# Altium project SensorControl_Board_v3.0.PrjPcb
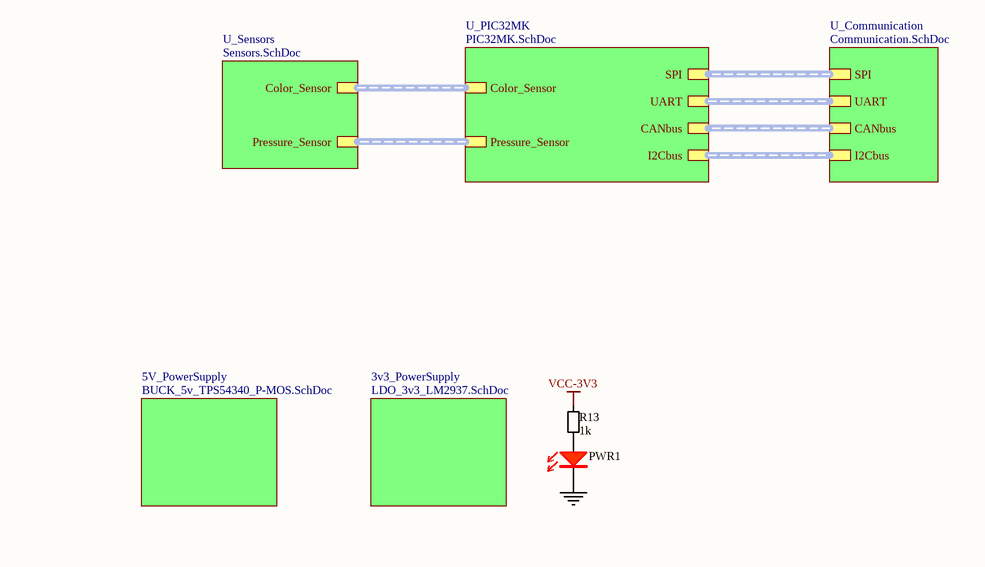
[diagram p0: SensorControl_Board_v3.0.SchDoc]
5 sheets, 84 parts. Net scope: hierarchical (ports join the sheet entries above them; power ports are global).
Board file: SensorControl_Board_v3.0.PcbDoc
Sheets:
  SensorControl_Board_v3.0.SchDoc
    5V_PowerSupply = BUCK_5v_TPS54340_P-MOS.SchDoc
    U_Sensors = Sensors.SchDoc
      Pressure_Sensor1 = Pressure_Sensor.SchDoc
      Pressure_Sensor2 = Pressure_Sensor.SchDoc
      Pressure_Sensor3 = Pressure_Sensor.SchDoc
      Pressure_Sensor4 = Pressure_Sensor.SchDoc
      Pressure_Sensor5 = Pressure_Sensor.SchDoc
      Pressure_Sensor6 = Pressure_Sensor.SchDoc
      Pressure_Sensor7 = Pressure_Sensor.SchDoc
      Pressure_Sensor8 = Pressure_Sensor.SchDoc
      Pressure_Sensor9 = Pressure_Sensor.SchDoc
      Pressure_Sensor10 = Pressure_Sensor.SchDoc
    U_PIC32MK = PIC32MK.SchDoc

## Sheet SensorControl_Board_v3.0.SchDoc
size A

### Parts
PWR1  LED RED  [LED_RED_0805]  (value not drawn)
R13  1k  [RESC2013X38N-0805-NOOVERLAY]

### Sub-sheets
3v3_PowerSupply = LDO_3v3_LM2937.SchDoc (file not in this document): no entries
5V_PowerSupply = BUCK_5v_TPS54340_P-MOS.SchDoc: no entries
U_Communication = Communication.SchDoc (file not in this document): SPI (harness SPI), UART (harness UART), CANbus (harness CANbus), I2Cbus (harness I2Cbus)
U_PIC32MK = PIC32MK.SchDoc: Color_Sensor (harness Color_Sensor), Pressure_Sensor (harness Pressure_Sensor), SPI (harness SPI), UART (harness UART), CANbus (harness CANbus), I2Cbus (harness I2Cbus)
U_Sensors = Sensors.SchDoc: Color_Sensor (harness Color_Sensor), Pressure_Sensor (harness Pressure_Sensor)

### Nets
GND: PWR1.1(C)
VCC-3V3: R13.2
NetPWR1_2: PWR1.2(A) R13.1

### Buses and harness runs
harness sheet U_Communication/CANbus = sheet U_PIC32MK/CANbus
harness sheet U_Communication/I2Cbus = sheet U_PIC32MK/I2Cbus
harness sheet U_Communication/SPI = sheet U_PIC32MK/SPI
harness sheet U_Communication/UART = sheet U_PIC32MK/UART
harness sheet U_PIC32MK/Color_Sensor = sheet U_Sensors/Color_Sensor
harness sheet U_PIC32MK/Pressure_Sensor = sheet U_Sensors/Pressure_Sensor

### Library data of the parts
PWR1 = LED_RED_0805: LED RED 0805; Manufacturer: BRIGHT LED ELECTRONICS; Manufacturer Part Number: BL-HUB35A-AV-TRB; Barcode: 2911010024321; id: 35; Assembly: SMD; Voltage Forward: 2.0 V; item_id: 3341; Recommended Rating: Platinum; Package Case: 0805 (2012 Metric); Color: Red; Family: LED; Part Type: Optoelectronics
R13 = 00001001: RES SMD 1 kOhm 1/8W 0805; Power: 0.125W, 1/8W; Barcode: 00009101; Resistance: 1k; Assembly: SMD

## Sheet BUCK_5v_TPS54340_P-MOS.SchDoc: Memristor Power 5.0
size A4; Author: Nikola Rašević; Organization: Memristor-Robotics; Address1: Vladimira Perića Valtera 2; Address2: 21000 Novi Sad; Address3: Serbia; Revision: v1
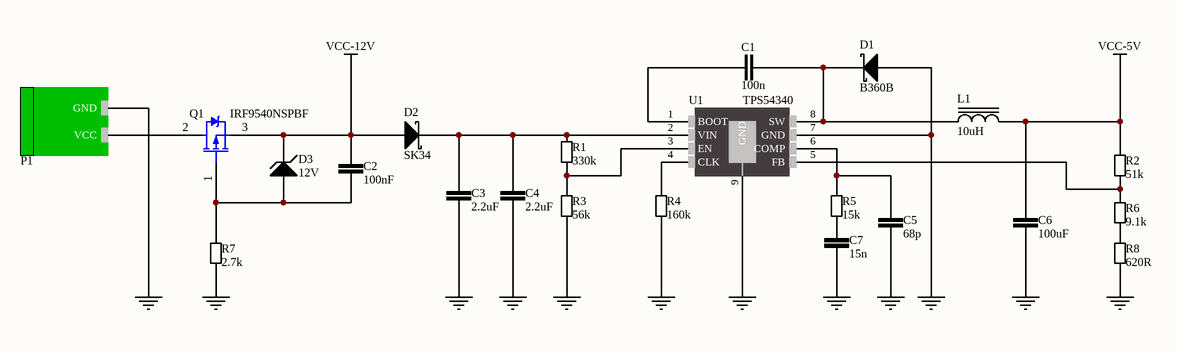
[diagram p1: BUCK_5v_TPS54340_P-MOS.SchDoc]

### Parts
C1  100n  [CER_0603]
C2  100nF  [CER_0805]
C3  2.2uF  [CER_1210]
C4  2.2uF  [CER_1210]
C5  68p  [CER_0603]
C6  100uF  [CER_1210]
C7  15n  [CER_0603]
D1  B360B  [DO214AC]
D2  SK34  [DO214AC]
D3  12V  [DO214AC]
L1  10uH  [INDUCTOR_SS1260-103MLD]
P1  2EDGRC-5.08-02P-14-00A(H)  [PWR_Con]  (value not drawn)
Q1  IRF9540NSPBF  [D2PAK-2]
R1  330k  [RESC2013X38N-0805-NOOVERLAY]
R2  51k  [RESC2013X38N-0805-NOOVERLAY]
R3  56k  [RESC2013X38N-0805-NOOVERLAY]
R4  160k  [RESC2013X38N-0805-NOOVERLAY]
R5  15k  [RESC2013X38N-0805-NOOVERLAY]
R6  9.1k  [RESC2013X38N-0805-NOOVERLAY]
R7  2.7k  [RESC2013X38N-0805-NOOVERLAY]
R8  620R  [RESC2013X38N-0805-NOOVERLAY]
U1  TPS54340  [HSOP-8]

### Nets
GND: C3.1 C4.1 C5.1 C6.1 C7.1 D1.2(Anode) P1.1(GND) R3.1 R4.1 R7.1 R8.1 U1.7(GND) U1.9(GND)
VCC-5V: C6.2 L1.2 R2.2
VCC-12V: C2.2 D2.2(Anode) D3.1(Cathode) Q1.3(S)
NetC1_1: C1.1 U1.1(BOOT)
NetC1_2: C1.2 D1.1(Cathode) L1.1 U1.8(SW)
NetC2_1: C2.1 D3.2(Anode) Q1.1(G) R7.2
NetC3_2: C3.2 C4.2 D2.1(Cathode) R1.2 U1.2(VIN)
NetC5_2: C5.2 R5.2 U1.6(COMP)
NetC7_2: C7.2 R5.1
NetP1_2: P1.2(VCC) Q1.2(D)
NetR1_1: R1.1 R3.2 U1.3(EN)
NetR2_1: R2.1 R6.2 U1.5(FB)
NetR4_2: R4.2 U1.4(CLK)
NetR6_1: R6.1 R8.2

### Notes on the sheet
- Title
- Date:
- Design Engineer:
- Time:
- Revision:
- Sheet
- of
- Size:
- A4
- www.memristor-robotics.io
- File:

### Library data of the parts
C1 = 06032105: CAP CER 100n 10V X5R 10% 0603; Capacitance: 100n
C2 = 00002105: CAP CER 100n 50V X7R 10% 0805; Capacitance: 100nF
C3 C4 = 00001225: CAP CER 2.2u; Value: 2.2uF
C5 = 06032680: CAP CER 68p 0603; Capacitance: 68p
C6 = 00002108: CAP CER 100u X5R 6.3V 10% 1210; Capacitance: 100uF
C7 = 06032153: CAP CER 15n 0603; Capacitance: 15n
D1 = B360B: DIODE SCHOTTKY 60V 3A DO214AC; Manufacturer: Vishay Semiconductor Diodes Division; Barcode: 0100000007488; id: 62; Assembly: SMD; Speed: Fast Recovery =< 500ns, > 200mA (Io); Voltage  Forward: 550mV @ 3A; item_id: 1025; Recommended Rating: Silver; Manufacturer Part Number: B360B; Category: Discrete Semiconductor Products; Datasheet URL: http://www.vishay.com/docs/88896/b330la.pdf; Package Case: DO-214AC, SMA; Family: DIODE; Voltage  DC Reverse: 60V; Current  Average Rectified: 3A; Diode Type: Schottky; Part Type: Discrete Semiconductors
D2 = SK34: DIODE SCHOTTKY 40V 3A DO214AC; Manufacturer: Vishay Semiconductor Diodes Division; Barcode: 0100000007488; id: 62; Assembly: SMD; Speed: Fast Recovery =< 500ns, > 200mA (Io); Voltage  Forward: 550mV @ 3A; item_id: 1025; Recommended Rating: Silver; Manufacturer Part Number: SK34; Category: Discrete Semiconductor Products; Datasheet URL: http://www.vishay.com/docs/88896/b330la.pdf; Package Case: DO-214AC, SMA; Family: DIODE; Voltage  DC Reverse: 40V; Current  Average Rectified: 3A; Diode Type: Schottky; Part Type: Discrete Semiconductors
D3 = ZENER: DIODE ZENER; Manufacturer: Vishay Semiconductor Diodes Division; Manufacturer Part Number: B360B; Barcode: 0100000007488; id: 62; Assembly: SMD; Speed: Fast Recovery =< 500ns, > 200mA (Io); Voltage  DC Reverse: 60V; Current  Average Rectified: 3A; Voltage  Forward: 550mV @ 3A; Diode Type: Schottky; item_id: 1025; Recommended Rating: Silver; Category: Discrete Semiconductor Products; Datasheet URL: http://www.vishay.com/docs/88896/b330la.pdf; Package Case: DO-214AC, SMA; Family: DIODE; Part Type: Discrete Semiconductors; Refferent Voltage: 12V
L1 = Inductor_10uH: FIXED IND 10uH 5.3A; Manufacturer: Coilcraft; Manufacturer Part Number: XAL7030-103MEB; Barcode: 2911010049126; id: 7; Assembly: SMD; Tolerance: 20%; Value: 10u; DC Resistance: 62.7mOhm; item_id: 5593; Category: Inductors, Coils, Chokes; Datasheet URL: http://www.mouser.com/ds/2/597/xal7030-270749.pdf; Package Case: 8x8mm; Inductance: 10uH; Current Rating: 5.3A; Family: INDUCTOR; Part Type: Inductor, Transf, Filter, Ferrite
P1 = 00000002: TERM BLOCK HDR 2POS 90DEG 5.08MM; Suplier: TME; Manufacturer Part Number: 2EDGRC-5.08-02P-14-00A(H); Suplier Product Link: https://www.tme.eu/en/details/2edgrc5.08-2p14/pluggable-terminal-blocks/degson-electronics/2edgrc-508-02p-14-00ah/; Price: 0.1304
Q1 = IRF9540N: P-MOS; Manufacturer: INTERNATIONAL RECTIFIER; Manufacturer Part Number: IRF9540NSPBF; Order Code: IRF9540NS; Package: TO-263 SMD; Price: DIN 62.54; Supplier: Comet.rs
R1 = 00003303: RES SMD 330 kOhm 1/8W 0805; Power: 0.125W, 1/8W; Resistance: 330k; Assembly: SMD; Barcode: 00003303
R2 = 00005102: RES SMD 51 kOhm 1/8W 0805; Power: 0.125W, 1/8W; Resistance: 51k; Assembly: SMD; Barcode: 00005102
R3 = 00005602: RES SMD 56 kOhm 1/8W 0805; Power: 0.125W, 1/8W; Barcode: 00004701; Resistance: 56k; Assembly: SMD
R4 = 00001603: RES SMD 160 kOhm 1/8W 0805; Power: 0.125W, 1/8W; Resistance: 160k; Assembly: SMD; Barcode: 00001603
R5 = 00001502: RES SMD 15 kOhm 1/8W 0805; Power: 0.125W, 1/8W; Resistance: 15k; Assembly: SMD; Barcode: 00001502
R6 = 00009101: RES SMD 9.1 kOhm 1/8W 0805; Power: 0.125W, 1/8W; Resistance: 9.1k; Assembly: SMD; Barcode: 00009101
R7 = 00002701: RES SMD 2.7 kOhm 1/8W 0805; Power: 0.125W, 1/8W; Barcode: 00004701; Resistance: 2.7k; Assembly: SMD
R8 = 00006200: RES SMD 620 Ohm 1/8W 0805; Power: 0.125W, 1/8W; Resistance: 620R; Assembly: SMD; Barcode: 00006200
U1 = TPS54340: IC REG BUCK ADJ 3.5A 8SOPWRPAD; Assembly: SMD; Manufacturer Part Number: TPS54340

## Sheet Sensors.SchDoc
size A4
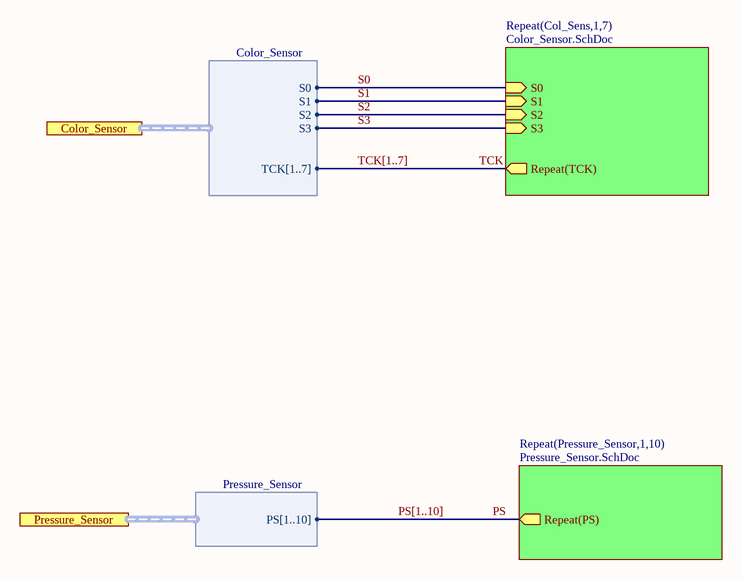
[diagram p2: Sensors.SchDoc]

### Sub-sheets
Repeat(Col_Sens,1,7) = Color_Sensor.SchDoc (file not in this document): S0 (in), S1 (in), S2 (in), S3 (in), Repeat(TCK) (out)
Repeat(Pressure_Sensor,1,10) = Pressure_Sensor.SchDoc: Repeat(PS) (out)

### Ports
Color_Sensor (harness Color_Sensor), Pressure_Sensor (harness Pressure_Sensor)

### Harnesses
Color_Sensor: TCK[1..7], S0, S1, S2, S3
Pressure_Sensor: PS[1..10]

### Nets
PS: sheet Repeat(Pressure_Sensor,1,10)/Repeat(PS)
S0: sheet Repeat(Col_Sens,1,7)/S0, port Color_Sensor.S0
S1: sheet Repeat(Col_Sens,1,7)/S1, port Color_Sensor.S1
S2: sheet Repeat(Col_Sens,1,7)/S2, port Color_Sensor.S2
S3: sheet Repeat(Col_Sens,1,7)/S3, port Color_Sensor.S3
TCK: sheet Repeat(Col_Sens,1,7)/Repeat(TCK)

### Buses and harness runs
bus PS[1..10]
bus TCK[1..7]

## Sheet Pressure_Sensor.SchDoc
size A4
Used 10 times, as channels U_Sensors/Pressure_Sensor1, U_Sensors/Pressure_Sensor2, U_Sensors/Pressure_Sensor3, U_Sensors/Pressure_Sensor4, U_Sensors/Pressure_Sensor5, U_Sensors/Pressure_Sensor6, U_Sensors/Pressure_Sensor7, U_Sensors/Pressure_Sensor8, U_Sensors/Pressure_Sensor9, U_Sensors/Pressure_Sensor10. Parts and nets are listed once, with the designators drawn on the sheet.
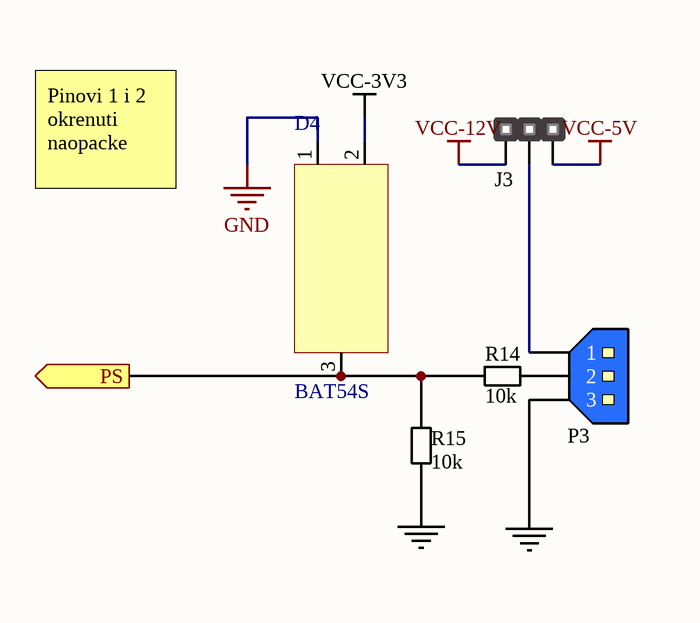
[diagram p3: Pressure_Sensor.SchDoc]

### Parts
D4  BAT54S  [BAT54S]
J3  *  [HM1X3]  (value not drawn)
P3  TE CONNECTIVITY_3PIN_MALE  [TE CONNECTIVITY_3PIN_MALE]  (value not drawn)
R14  10k  [RESC2013X38N-0805-NOOVERLAY]
R15  10k  [RESC2013X38N-0805-NOOVERLAY]

### Ports
PS (out)

### Nets
GND: P3.3 R15.1
VCC-5V: J3.3
VCC-12V: J3.1
PS: D4.3 R14.2 R15.2 ; port PS
NetJ3_2: J3.2 P3.1
NetP3_2: P3.2 R14.1

Not connected (* = marked no-connect by the designer): D4 1 2

### Channels
U_Sensors/Pressure_Sensor1: designators end in _Pressure_Sensor1; ports PS=PS1
U_Sensors/Pressure_Sensor2: designators end in _Pressure_Sensor2; ports PS=PS2
U_Sensors/Pressure_Sensor3: designators end in _Pressure_Sensor3; ports PS=PS3
U_Sensors/Pressure_Sensor4: designators end in _Pressure_Sensor4; ports PS=PS4
U_Sensors/Pressure_Sensor5: designators end in _Pressure_Sensor5; ports PS=PS5
U_Sensors/Pressure_Sensor6: designators end in _Pressure_Sensor6; ports PS=PS6
U_Sensors/Pressure_Sensor7: designators end in _Pressure_Sensor7; ports PS=PS7
U_Sensors/Pressure_Sensor8: designators end in _Pressure_Sensor8; ports PS=PS8
U_Sensors/Pressure_Sensor9: designators end in _Pressure_Sensor9; ports PS=PS9
U_Sensors/Pressure_Sensor10: designators end in _Pressure_Sensor10; ports PS=PS10

### Notes on the sheet
- Pinovi 1 i 2 okrenuti naopacke

### Library data of the parts
J3 = HEADER_1x3: Manufacturer Part Number: *
P3 = TE CONNECTIVITY_3PIN_MALE: BLUE_3PIN_CONECTOR; Manufacturer: TE CONNECTIVITY / AMP; Manufacturer Part Number 1: 281695-3; Order Code 1: 1205983; Price 1: £0.403; Supplier 1: uk.farnell.com
R14 R15 = 000001002: RES SMD 10 kOhm 1/8W 0805; Resistance: 10k

## Sheet PIC32MK.SchDoc
size A3
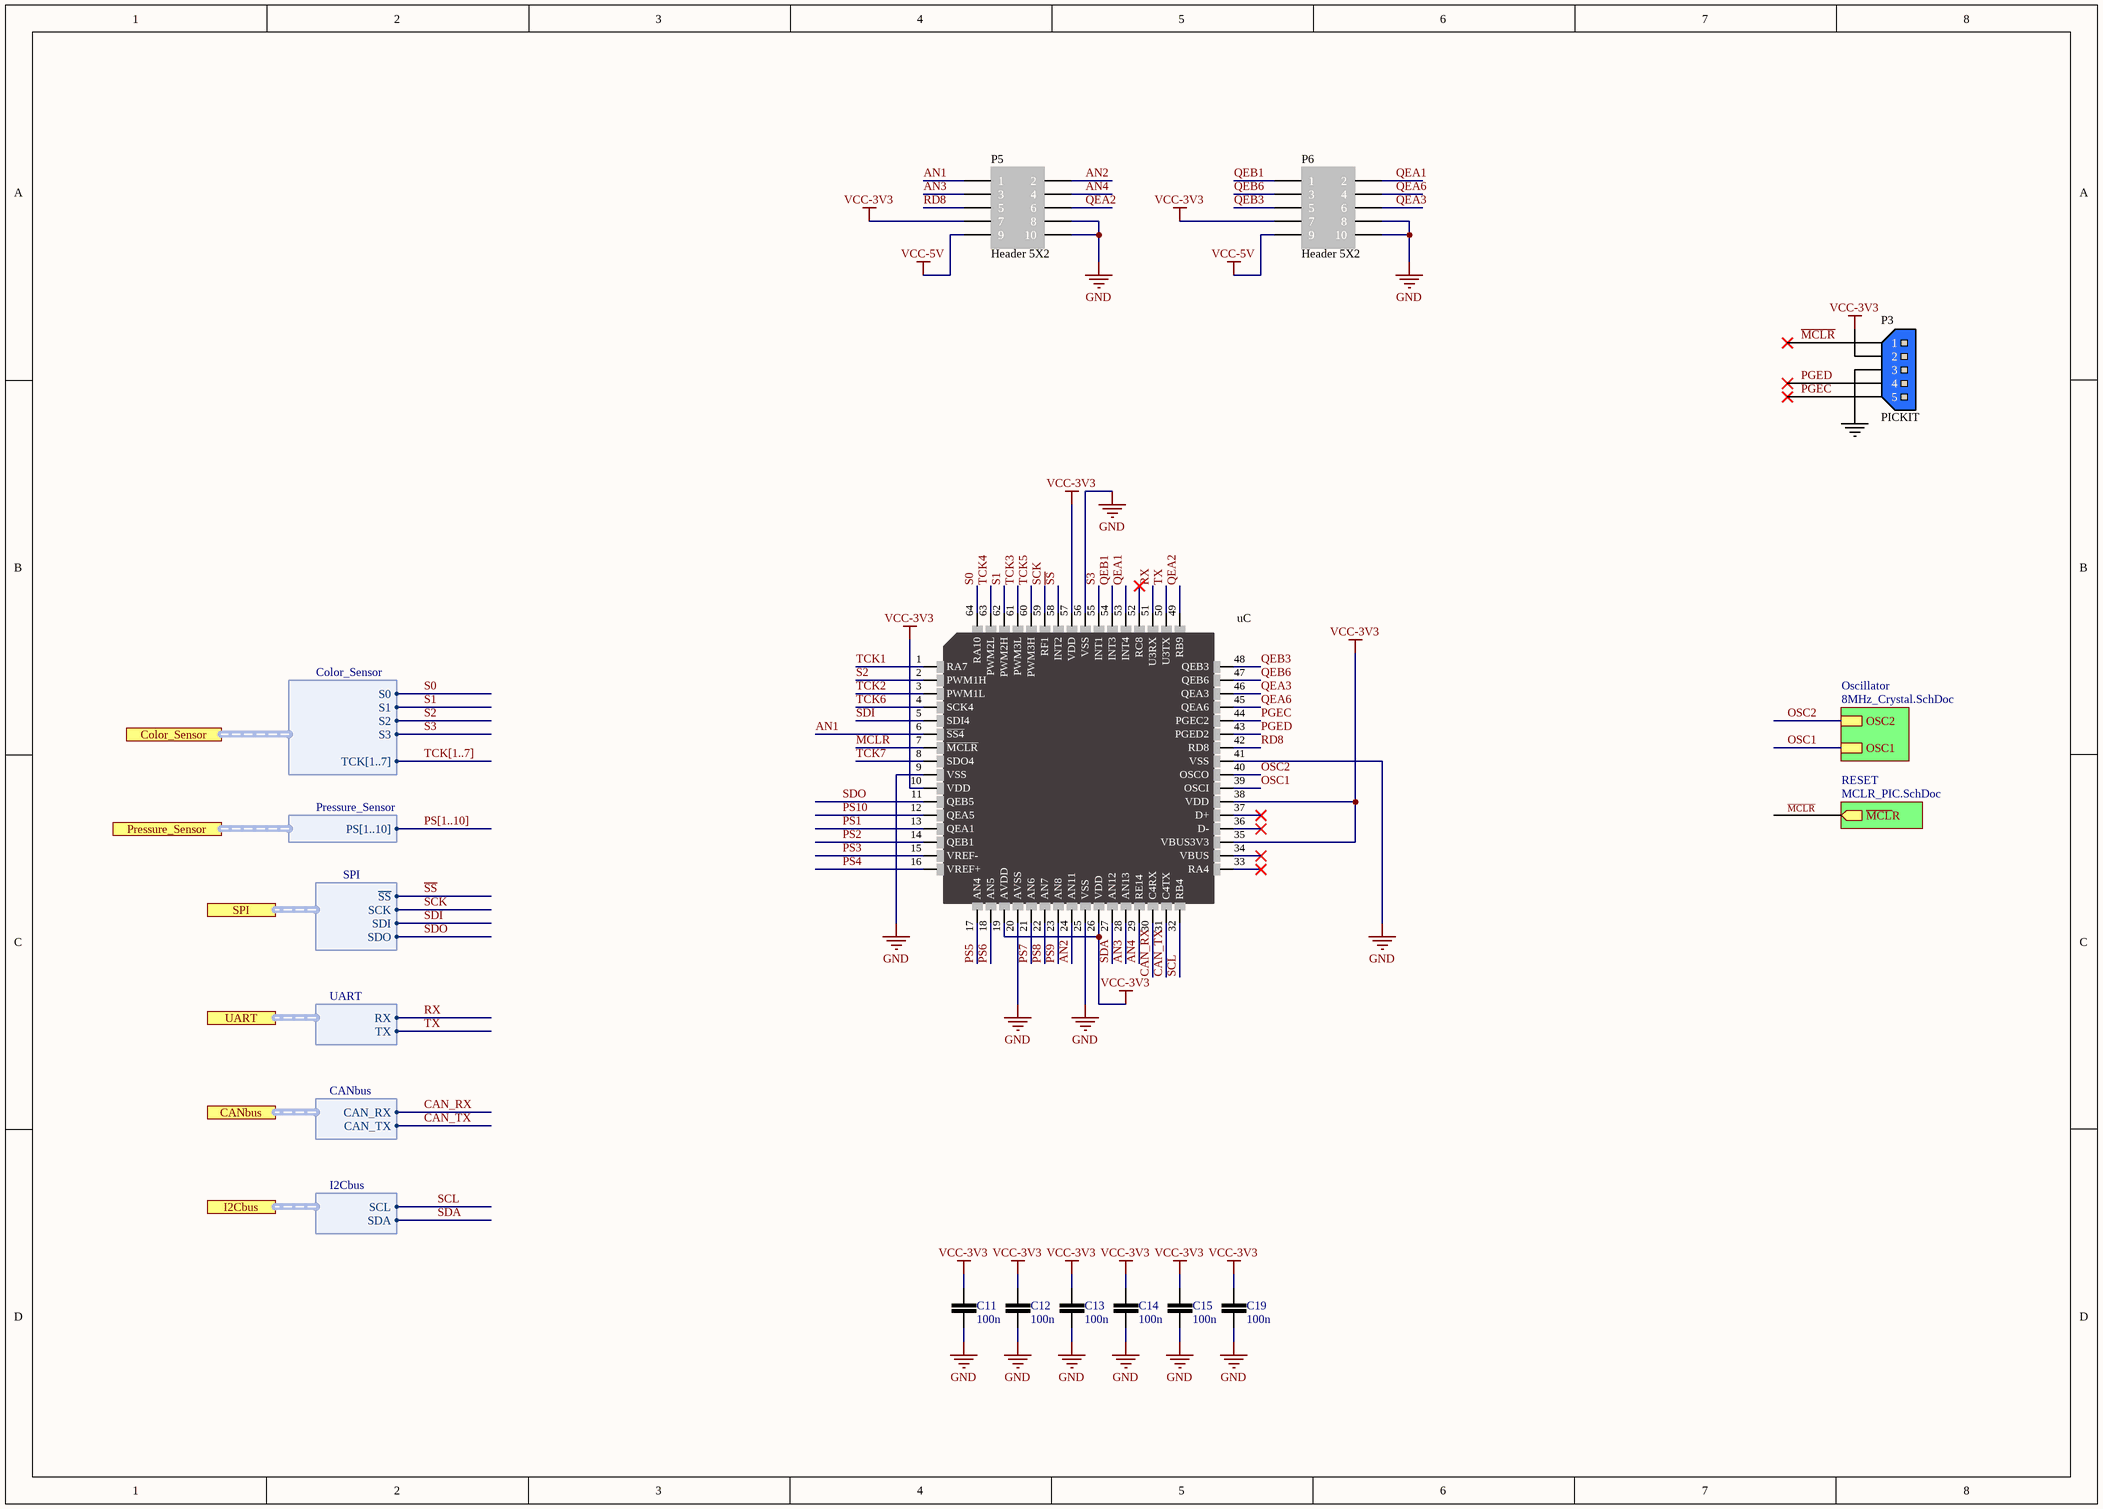
[diagram p4: PIC32MK.SchDoc]

### Parts
C11  100n  [CER_0805]
C12  100n  [CER_0805]
C13  100n  [CER_0805]
C14  100n  [CER_0805]
C15  100n  [CER_0805]
C19  100n  [CER_0805]
P3  PICKIT  [TE CONNECTIVITY_5PIN_MALE]
P5  Header 5X2  [CONNECTOR_2X5]
P6  Header 5X2  [CONNECTOR_2X5]
uC  (no value)  [TQFP-64-500um]

### Sub-sheets
Oscillator = 8MHz_Crystal.SchDoc (file not in this document): OSC1, OSC2
RESET = MCLR_PIC.SchDoc (file not in this document): ~{MCL}R (out)

### Ports
CANbus (harness CANbus), Color_Sensor (harness Color_Sensor), I2Cbus (harness I2Cbus), Pressure_Sensor (harness Pressure_Sensor), SPI (harness SPI), UART (harness UART)

### Harnesses
Color_Sensor: TCK[1..7], S0, S1, S2, S3
Pressure_Sensor: PS[1..10]
SPI: ~{SS}, SCK, SDI, SDO
UART: RX, TX
CANbus: CAN_RX, CAN_TX
I2Cbus: SCL, SDA

### Nets
GND: C11.1 C12.1 C13.1 C14.1 C15.1 C19.1 P3.3 P5.8 P5.10 P6.8 P6.10 uC.9(VSS) uC.20(AVSS) uC.25(VSS) uC.41(VSS) uC.56(VSS)
VCC-3V3: C11.2 C12.2 C13.2 C14.2 C15.2 C19.2 P3.2 P5.7 P6.7 uC.10(VDD) uC.19(AVDD) uC.26(VDD) uC.35(VBUS3V3) uC.38(VDD) uC.57(VDD)
VCC-5V: P5.9 P6.9
AN1: P5.1 uC.6(~{SS4})
AN2: P5.2 uC.24(AN11)
AN3: P5.3 uC.28(AN13)
AN4: P5.4 uC.29(RE14)
CAN_RX: uC.30(C4RX) ; port CANbus.CAN_RX
CAN_TX: uC.31(C4TX) ; port CANbus.CAN_TX
~{MCLR}: P3.1 uC.7(~{MCLR}) ; sheet RESET/~{MCL}R
OSC1: uC.39(OSCI) ; sheet Oscillator/OSC1
OSC2: uC.40(OSCO) ; sheet Oscillator/OSC2
PGEC: P3.5 uC.44(PGEC2)
PGED: P3.4 uC.43(PGED2)
PS1: uC.13(QEA1)
PS2: uC.14(QEB1)
PS3: uC.15(VREF-)
PS4: uC.16(VREF+)
PS5: uC.17(AN4)
PS6: uC.18(AN5)
PS7: uC.21(AN6)
PS8: uC.22(AN7)
PS9: uC.23(AN8)
PS10: uC.12(QEA5)
QEA1: P6.2 uC.53(INT4)
QEA2: P5.6 uC.49(RB9)
QEA3: P6.6 uC.46(QEA3)
QEA6: P6.4 uC.45(QEA6)
QEB1: P6.1 uC.54(INT3)
QEB3: P6.5 uC.48(QEB3)
QEB6: P6.3 uC.47(QEB6)
RD8: P5.5 uC.42(RD8)
RX: uC.51(U3RX) ; port UART.RX
S0: uC.64(RA10) ; port Color_Sensor.S0
S1: uC.62(PWM2H) ; port Color_Sensor.S1
S2: uC.2(PWM1H) ; port Color_Sensor.S2
S3: uC.55(INT1) ; port Color_Sensor.S3
~{SS}: uC.58(INT2) ; port SPI.~{SS}
SCK: uC.59(RF1) ; port SPI.SCK
SCL: uC.32(RB4) ; port I2Cbus.SCL
SDA: uC.27(AN12) ; port I2Cbus.SDA
SDI: uC.5(SDI4) ; port SPI.SDI
SDO: uC.11(QEB5) ; port SPI.SDO
TCK1: uC.1(RA7)
TCK2: uC.3(PWM1L)
TCK3: uC.61(PWM3L)
TCK4: uC.63(PWM2L)
TCK5: uC.60(PWM3H)
TCK6: uC.4(SCK4)
TCK7: uC.8(SDO4)
TX: uC.50(U3TX) ; port UART.TX

Not connected (* = marked no-connect by the designer): uC 33(RA4)* 34(VBUS)* 36(D-)* 37(D+)* 52(RC8)*

### Buses and harness runs
bus PS[1..10]
bus TCK[1..7]

### Library data of the parts
C11-C15 C19 = 0100000001868: Manufacturer: Yageo; Manufacturer Part Number: CC0805KRX7R9BB104; id: 136; Assembly: SMD; Temperature Coefficient: X7R; Tolerance: 10%; Voltage Rated: 50; item_id: 450; Recommended Rating: Platinum; Barcode: 0100000001868; Category: Capacitors; Capacitance: 100n; Package Case: 0805; Family: CERAMIC CAPACITOR; Part Type: Capacitors
P3 = TE CONNECTIVITY_5PIN_MALE: BLUE_5PIN_CONECTOR; Manufacturer: TE CONNECTIVITY / AMP; Manufacturer Part Number 1: 281695-3; Order Code 1: 1205983; Price 1: £0.403; Supplier 1: uk.farnell.com
P5 P6 = Header 5X2: Header, 5-Pin, Dual row; LatestRevisionDate: 17-Jul-2002; LatestRevisionNote: Re-released for DXP Platform.; Publisher: Altium Limited
uC = PIC32MK1024MCF064: IC MCU 32BIT 1MB FLASH 64TQFP; Manufacturer Part Number: PIC32MK1024MCF064

## Nets that join several sheets
GND: SensorControl_Board_v3.0 (PWR1.1), BUCK_5v_TPS54340_P-MOS (13 pins), U_Sensors/Pressure_Sensor1 (P3_Pressure_Sensor1.3 R15_Pressure_Sensor1.1), U_Sensors/Pressure_Sensor2 (P3_Pressure_Sensor2.3 R15_Pressure_Sensor2.1), U_Sensors/Pressure_Sensor3 (P3_Pressure_Sensor3.3 R15_Pressure_Sensor3.1), U_Sensors/Pressure_Sensor4 (P3_Pressure_Sensor4.3 R15_Pressure_Sensor4.1), U_Sensors/Pressure_Sensor5 (P3_Pressure_Sensor5.3 R15_Pressure_Sensor5.1), U_Sensors/Pressure_Sensor6 (P3_Pressure_Sensor6.3 R15_Pressure_Sensor6.1), U_Sensors/Pressure_Sensor7 (P3_Pressure_Sensor7.3 R15_Pressure_Sensor7.1), U_Sensors/Pressure_Sensor8 (P3_Pressure_Sensor8.3 R15_Pressure_Sensor8.1), U_Sensors/Pressure_Sensor9 (P3_Pressure_Sensor9.3 R15_Pressure_Sensor9.1), U_Sensors/Pressure_Sensor10 (P3_Pressure_Sensor10.3 R15_Pressure_Sensor10.1), PIC32MK (16 pins)
VCC-3V3: SensorControl_Board_v3.0 (R13.2), PIC32MK (15 pins)
VCC-5V: BUCK_5v_TPS54340_P-MOS (C6.2 L1.2 R2.2), U_Sensors/Pressure_Sensor1 (J3_Pressure_Sensor1.3), U_Sensors/Pressure_Sensor2 (J3_Pressure_Sensor2.3), U_Sensors/Pressure_Sensor3 (J3_Pressure_Sensor3.3), U_Sensors/Pressure_Sensor4 (J3_Pressure_Sensor4.3), U_Sensors/Pressure_Sensor5 (J3_Pressure_Sensor5.3), U_Sensors/Pressure_Sensor6 (J3_Pressure_Sensor6.3), U_Sensors/Pressure_Sensor7 (J3_Pressure_Sensor7.3), U_Sensors/Pressure_Sensor8 (J3_Pressure_Sensor8.3), U_Sensors/Pressure_Sensor9 (J3_Pressure_Sensor9.3), U_Sensors/Pressure_Sensor10 (J3_Pressure_Sensor10.3), PIC32MK (P5.9 P6.9)
VCC-12V: BUCK_5v_TPS54340_P-MOS (C2.2 D2.2 D3.1 Q1.3), U_Sensors/Pressure_Sensor1 (J3_Pressure_Sensor1.1), U_Sensors/Pressure_Sensor2 (J3_Pressure_Sensor2.1), U_Sensors/Pressure_Sensor3 (J3_Pressure_Sensor3.1), U_Sensors/Pressure_Sensor4 (J3_Pressure_Sensor4.1), U_Sensors/Pressure_Sensor5 (J3_Pressure_Sensor5.1), U_Sensors/Pressure_Sensor6 (J3_Pressure_Sensor6.1), U_Sensors/Pressure_Sensor7 (J3_Pressure_Sensor7.1), U_Sensors/Pressure_Sensor8 (J3_Pressure_Sensor8.1), U_Sensors/Pressure_Sensor9 (J3_Pressure_Sensor9.1), U_Sensors/Pressure_Sensor10 (J3_Pressure_Sensor10.1)
PS1: U_Sensors/Pressure_Sensor1 (D4_Pressure_Sensor1.3 R14_Pressure_Sensor1.2 R15_Pressure_Sensor1.2), PIC32MK (uC.13)
PS2: U_Sensors/Pressure_Sensor2 (D4_Pressure_Sensor2.3 R14_Pressure_Sensor2.2 R15_Pressure_Sensor2.2), PIC32MK (uC.14)
PS3: U_Sensors/Pressure_Sensor3 (D4_Pressure_Sensor3.3 R14_Pressure_Sensor3.2 R15_Pressure_Sensor3.2), PIC32MK (uC.15)
PS4: U_Sensors/Pressure_Sensor4 (D4_Pressure_Sensor4.3 R14_Pressure_Sensor4.2 R15_Pressure_Sensor4.2), PIC32MK (uC.16)
PS5: U_Sensors/Pressure_Sensor5 (D4_Pressure_Sensor5.3 R14_Pressure_Sensor5.2 R15_Pressure_Sensor5.2), PIC32MK (uC.17)
PS6: U_Sensors/Pressure_Sensor6 (D4_Pressure_Sensor6.3 R14_Pressure_Sensor6.2 R15_Pressure_Sensor6.2), PIC32MK (uC.18)
PS7: U_Sensors/Pressure_Sensor7 (D4_Pressure_Sensor7.3 R14_Pressure_Sensor7.2 R15_Pressure_Sensor7.2), PIC32MK (uC.21)
PS8: U_Sensors/Pressure_Sensor8 (D4_Pressure_Sensor8.3 R14_Pressure_Sensor8.2 R15_Pressure_Sensor8.2), PIC32MK (uC.22)
PS9: U_Sensors/Pressure_Sensor9 (D4_Pressure_Sensor9.3 R14_Pressure_Sensor9.2 R15_Pressure_Sensor9.2), PIC32MK (uC.23)
PS10: U_Sensors/Pressure_Sensor10 (D4_Pressure_Sensor10.3 R14_Pressure_Sensor10.2 R15_Pressure_Sensor10.2), PIC32MK (uC.12)